# Altium project PCB_Project.PrjPcb
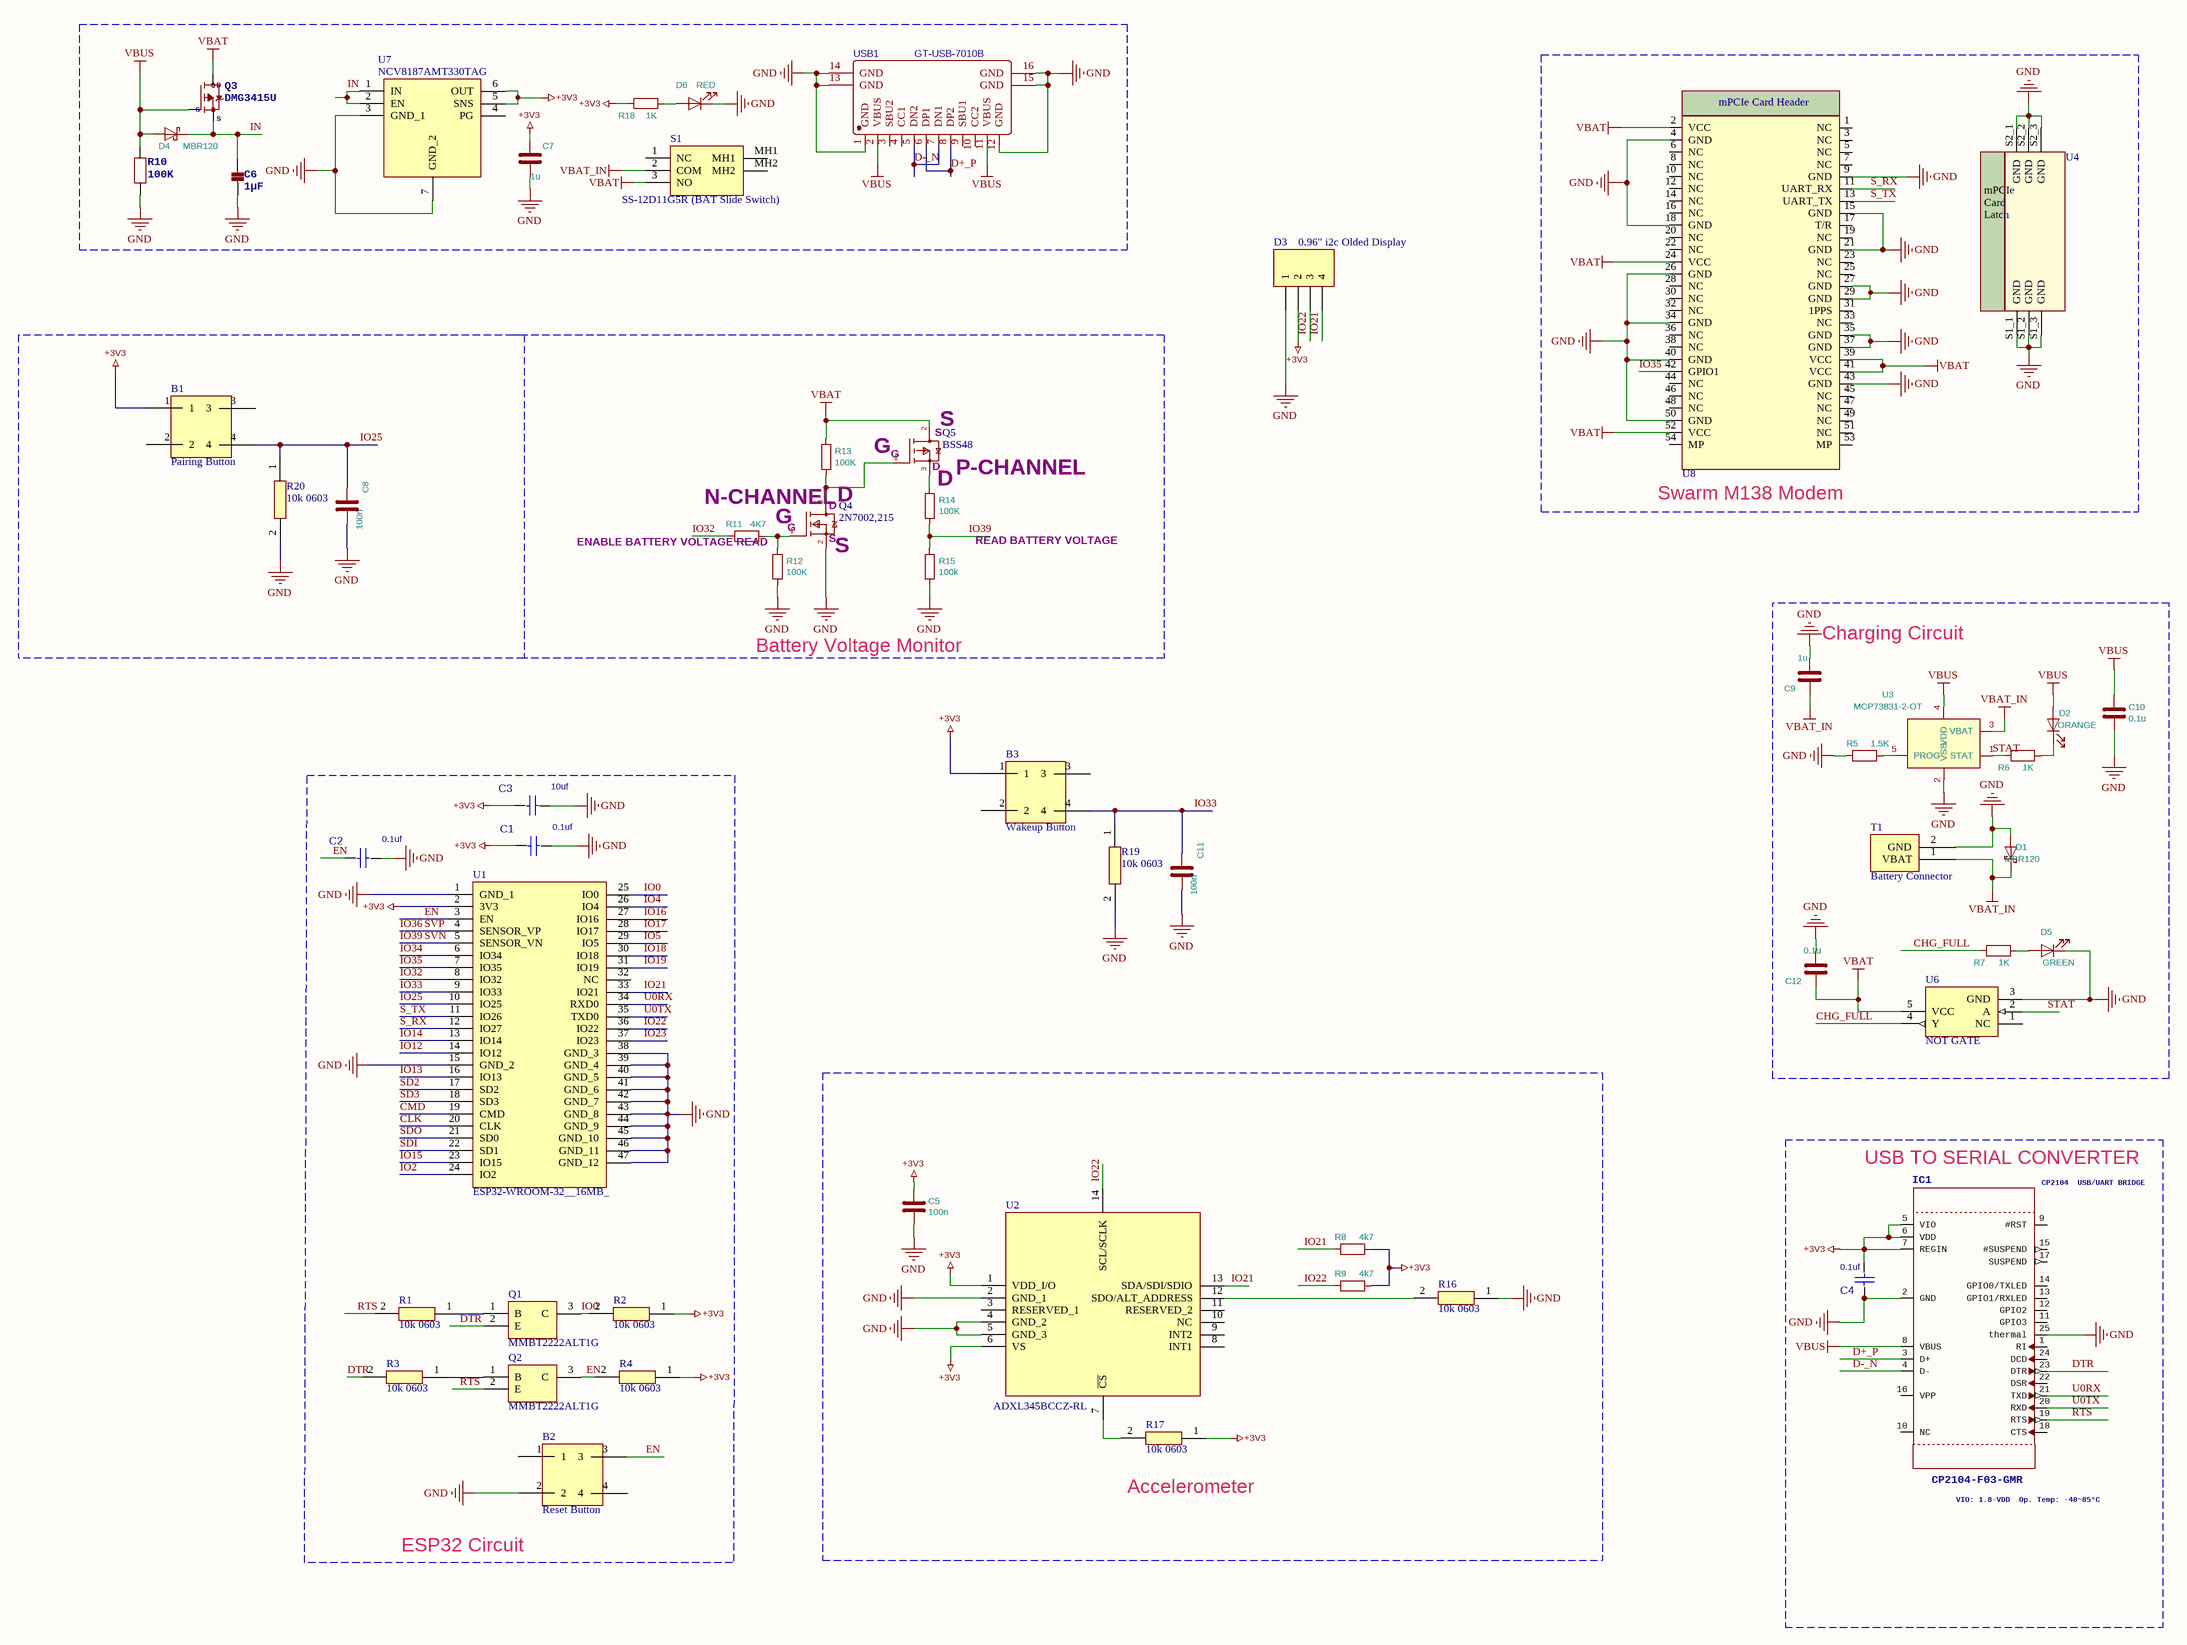
[diagram p0: Sheet1.SchDoc]
1 sheet, 57 parts. Net scope: global (net labels, ports and power ports of the same name join across sheets).
Board file: PCB1.PcbDoc

## Sheet Sheet1.SchDoc
size C

### Parts
B1  Pairing Button  [KMR221NGLFS]
B2  Reset Button  [KMR221NGLFS]
B3  Wakeup Button  [KMR221NGLFS]
C1  value 0.1uf  [0603 Capacitor]  (hidden comment: CAPC1608N-0.1UF)
C2  value 0.1uf  [0603 Capacitor]  (hidden comment: CAPC1608N-0.1UF)
C3  value 10uf  [0603 Capacitor]  (hidden comment: CAPC1608N-0.1UF)
C4  value 0.1uf  [0603 Capacitor]  (hidden comment: CAPC1608N-0.1UF)
C5  100n  [0603 Capacitor]
C6  1µF  [0603 Capacitor]
C7  value 1u  [0603 Capacitor]  (hidden comment: 10u)
C8  100n  [0603 Capacitor]
C9  value 1u  [0603 Capacitor]  (hidden comment: 10u)
C10  value 0.1u  [0603 Capacitor]  (hidden comment: 1u)
C11  100n  [0603 Capacitor]
C12  value 0.1u  [0603 Capacitor]  (hidden comment: 0.1uF)
D1  MBR120  [SODFL3616X98N]
D2  ORANGE  [LED]
D3  0.96" i2c Olded Display  [i2c display]
D4  MBR120  [SODFL3616X98N]
D5  value GREEN  [LED]  (hidden comment: ORANGE)
D6  value RED  [LED]  (hidden comment: ORANGE)
IC1  CP2104-F03-GMR  CP2104
USB/UARTBRIDGE: CP2104 / USB/UART BRIDGE  VIO:1.8-VDD
Op.Temp:-40~85°C: VIO: 1.8-VDD / Op. Temp: -40~85°C  [cp2104]
Q1  MMBT2222ALT1G  [SOT96P237X111-3N]
Q2  MMBT2222ALT1G  [SOT96P237X111-3N]
Q3  DMG3415U  [SOT96P237X111-3N]
Q4  2N7002,215  [SOT96P237X111-3N]
Q5  BSS48  [SOT96P237X111-3N]
R1  10k 0603  [RES0603]
R2  10k 0603  [RES0603]
R3  10k 0603  [RES0603]
R4  10k 0603  [RES0603]
R5  value 1.5K  [RES0603]  (hidden comment: 10K)
R6  1K  [RES0603]
R7  1K  [RES0603]
R8  value 4k7  [RES0603]  (hidden comment: 4k7 0603)
R9  value 4k7  [RES0603]  (hidden comment: 4k7 0603)
R10  100K  [RES0603]
R11  4K7  [RES0603]
R12  100K  [RES0603]
R13  100K  [RES0603]
R14  value 100K  [RES0603]  (hidden comment: 330K)
R15  100K  [RES0603]
R16  10k 0603  [RES0603]
R17  10k 0603  [RES0603]
R18  1K  [RES0603]
R19  10k 0603  [RES0603]
R20  10k 0603  [RES0603]
S1  SS-12D11G5R (BAT Slide Switch)  [SS12D11G5R]
T1  Battery Connector  [Battery Connector]
U1  ESP32-WROOM-32__16MB_  [ESP32]
U2  ADXL345BCCZ-RL  [ADXL345BCCZRL]
U3  MCP73831-2-OT  [SOT95P270X145-5N]
U4  Component_2  [m.2]  (value not drawn)
U6  NOT GATE  [SOT95P270X145-5N]
U7  NCV8187AMT330TAG  [SON65P200X200X80-7N]
U8  SWARM_M138_mPCIe_2.005"_VHF  [RF_VHF_JAE_MM60-52B1-B1-R850_MM60-EZH039-B5-R850_w_2005_mPCIe_card]  (value not drawn)
USB1  GT-USB-7010B  [type c]

### Blocks framed on the sheet
Swarm M138 Modem: U4 U8
Charging Circuit: C9 C10 C12 D1 D2 D5 R5-R7 T1 U3 U6
Accelerometer: C5 R8 R9 R16 R17 U2
USB TO SERIAL CONVERTER: C4 IC1

### Nets
+3V3: B1.1 B3.1 C1.2 C3.2 C4.1 C5.1 C7.1 D3.2 IC1.5(VIO) IC1.6(VDD) IC1.7(REGIN) R2.1 R4.1 R8.1 R9.1 R17.1 R18.2 U1.2(3V3) U2.1(VDD_I/O) U2.6(VS) U7.5(SNS) U7.6(OUT)
GND: B2.2 C1.1 C2.1 C3.1 C4.2 C5.2 C6.2 C7.2 C8.2 C9.2 C10.2 C11.2 C12.2 D1.2(A) D3.1 D5.1(K) D6.1(K) IC1.2(GND) IC1.25(thermal) Q4.2(S) R5.2 R10.1 R12.2 R15.2 R16.1 R19.2 R20.2 T1.2(GND) U1.1(GND_1) U1.15(GND_2) U1.38(GND_3) U1.39(GND_4) U1.40(GND_5) U1.41(GND_6) U1.42(GND_7) U1.43(GND_8) U1.44(GND_9) U1.45(GND_10) U1.46(GND_11) U1.47(GND_12) U2.2(GND_1) U2.4(GND_2) U2.5(GND_3) U3.2(VSS) U4.S1_1(GND) U4.S1_2(GND) U4.S1_3(GND) U4.S2_1(GND) U4.S2_2(GND) U4.S2_3(GND) U6.3(GND) U7.3(GND_1) U7.7(GND_2) U8.4(GND) U8.9(GND) U8.15(GND) U8.18(GND) U8.21(GND) U8.26(GND) U8.27(GND) U8.29(GND) U8.34(GND) U8.35(GND) U8.37(GND) U8.40(GND) U8.43(GND) U8.50(GND) USB1.1(GND) USB1.12(GND) USB1.13(GND) USB1.14(GND) USB1.15(GND) USB1.16(GND)
VBAT: C12.1 Q3.3(D) Q5.2(D1) R13.1 S1.3(NO) U6.5(VCC) U8.2(VCC) U8.24(VCC) U8.39(VCC) U8.41(VCC) U8.52(VCC)
VBAT_IN: C9.1 D1.1(K) S1.2(COM) T1.1(VBAT) U3.3(VBAT)
VBUS: C10.1 D2.2(A) D4.2(A) IC1.8(VBUS) Q3.1(G) R10.2 U3.4(VDD) USB1.2(VBUS) USB1.11(VBUS)
CHG_FULL: R7.2 U6.4(Y)
CLK: U1.20(CLK)
CMD: U1.19(CMD)
D+_P: IC1.3(D+) USB1.6(DP1) USB1.8(DP2)
D-_N: IC1.4(D-) USB1.5(DN2) USB1.7(DN1)
DTR: IC1.23(DTR) Q1.2(E) R3.2
EN: B2.3 C2.2 Q2.3(C) R4.2 U1.3(EN)
IN: C6.1 D4.1(K) Q3.2(S) U7.1(IN) U7.2(EN)
IO0: Q1.3(C) R2.2 U1.25(IO0)
IO2: U1.24(IO2)
IO4: U1.26(IO4)
IO5: U1.29(IO5)
IO12: U1.14(IO12)
IO13: U1.16(IO13)
IO14: U1.13(IO14)
IO15: U1.23(IO15)
IO16: U1.27(IO16)
IO17: U1.28(IO17)
IO18: U1.30(IO18)
IO19: U1.31(IO19)
IO21: D3.4 R8.2 U1.33(IO21) U2.13(SDA/SDI/SDIO)
IO22: D3.3 R9.2 U1.36(IO22) U2.14(SCL/SCLK)
IO23: U1.37(IO23)
IO25: B1.4 C8.1 R20.1 U1.10(IO25)
IO32: R11.2 U1.8(IO32)
IO33: B3.4 C11.1 R19.1 U1.9(IO33)
IO34: U1.6(IO34)
IO35: U1.7(IO35) U8.42(GPIO1)
IO36: U1.4(SENSOR_VP)  [also labelled SVP]
IO39: R14.2 R15.1 U1.5(SENSOR_VN)  [also labelled SVN]
RTS: IC1.19(RTS) Q2.2(E) R1.2
S_RX: U1.12(IO27) U8.11(UART_RX)
S_TX: U1.11(IO26) U8.13(UART_TX)
SD2: U1.17(SD2)
SD3: U1.18(SD3)
SDI: U1.22(SD1)
SDO: U1.21(SD0)
STAT: R6.2 U3.1(STAT) U6.2(A)
U0RX: IC1.21(TXD) U1.34(RXD0)
U0TX: IC1.20(RXD) U1.35(TXD0)
NetD2_1: D2.1(K) R6.1
NetD5_2: D5.2(A) R7.1
NetD6_2: D6.2(A) R18.1
NetQ1_1: Q1.1(B) R1.1
NetQ2_1: Q2.1(B) R3.1
NetQ4_1: Q4.1(G) R11.1 R12.1
NetQ4_3: Q4.3(D1) Q5.1(G) R13.2
NetQ5_3: Q5.3(S) R14.1
NetR5_1: R5.1 U3.5(PROG)
NetR16_2: R16.2 U2.12(SDO/ALT_ADDRESS)
NetR17_2: R17.2 U2.7(~{CS})

Not connected (* = marked no-connect by the designer): B1 2 3; B2 1 4; B3 2 3; IC1 1(RI) 9(#RST) 10(NC) 11(GPIO3) 12(GPIO2) 13(GPIO1/RXLED) 14(GPIO0/TXLED) 15(#SUSPEND) 16(VPP) 17(SUSPEND) 18(CTS) 22(DSR) 24(DCD); S1 1(NC) MH1 MH2; U1 32(NC); U2 3(RESERVED_1) 8(INT1) 9(INT2) 10(NC) 11(RESERVED_2); U6 1(NC); U7 4(PG); U8 1(NC) 3(NC) 5(NC) 6(NC) 7(NC) 8(NC) 10(NC) 12(NC) 14(NC) 16(NC) 17(T/R) 19(NC) 20(NC) 22(NC) 23(NC) 25(NC) 28(NC) 30(NC) 31(1PPS) 32(NC) 33(NC) 36(NC) 38(NC) 44(NC) 45(NC) 46(NC) 47(NC) 48(NC) 49(NC) 51(NC) 53(MP) 54(MP); USB1 3(SBU2) 4(CC1) 9(SBU1) 10(CC2)

### Notes on the sheet
- (near Q5) S
- (near Q4) N-CHANNEL
- D
- (near Q5) G
- P-CHANNEL
- (near R11) ENABLE BATTERY VOLTAGE READ
- G
- (near Q4) S
- READ BATTERY VOLTAGE
- Battery Voltage Monitor
- ESP32 Circuit
- (in symbol 2N7002) D
- (in symbol BSS84) D
- (in symbol Component_2) mPCIe Card Latch
- (in symbol SWARM_M138_mPCIe_2.005"_VHF) mPCIe Card Header

### Library data of the parts
B1-B3 = Button: Manufacturer_Part_Number: KMR221NGLFS; LCSC Part Number: C269272
C1-C4 = CAPC1608N-0.1UF: CAP CER 0.1UF 25V X7R 0603; Manufacturer_Name: TDK Corporation; Manufacturer_Part_Number: CGA3E2X7R1E104K080AA; PCB DECAL: CAPC1608X55N; Mouser Part Number: 963-TMF212B7104KGHT; Mouser Price/Stock: https://www2.mouser.com/ProductDetail/Taiyo-Yuden/TMF212B7104KGHT?qs=%252B6g0mu59x7Jv7XISa3hIWA%3D%3D; LCSC Part Number: *
C5 C8 C11 = 100n_0603: Part Number: C0603C104J5RACTU; Generic Part: no; Manufacturer: KEMET; Value: 100n; Footprint: Capacitor_SMD:C_0603_1608Metric
  C5: LCSC Part Number: *
C6 = CAP_CERAMIC0805-NOOUTLINE: Ceramic Capacitors   For new designs, use the packages preceded by an '_' character since they are more reliable:   The following footprints should be used on most boards: _0402 - Standard footprint for regular board layouts  _0603 - Standard footprint for regular board layouts  _0805 - Standard footprint for regular board layouts  _1206 - Standard footprint for regular board layouts       For extremely tight-pitch boards where space is at a premium, the following 'micro-pitch' footprints can be used (smaller pads, no silkscreen outline, etc.): _0402MP - Micro-pitch footprint for very dense/compact boards  _0603MP - Micro-pitch footprint for very dense/compact boards  _0805MP - Micro-pitch footprint for very dense/compact boards  _1206MP - Micro-pitch footprint for very dense/compact boards; COMPANY: ADAFRUIT INDUSTRIES; DRAWN: KTOWN; REV: B; LCSC Part Number: *; Manufacturer_Part_Number: *
C7 C9 C10 C12 = 10u_0603: Part Number: C0603C106M9PACTU; Generic Part: no; Manufacturer: KEMET; Footprint: Capacitor_SMD:C_0603_1608Metric; LCSC Part Number: *
D1 D4 = MBR0520: Manufacturer_Part_Number: LMBR120FT1G; Generic Part: no; Manufacturer: ON; Value: MBR120; Footprint: Diode_SMD:D_SOD-123; LCSC Part Number: C81143
D2 D6 = LED: Generic Part: yes; Manufacturer: Kingbright; Manufacturer_Part_Number: APT1608SECK; Footprint: LED_SMD:LED_0603_1608Metric; LCSC Part Number: *
  D2: Value: ORANGE
D3 = Header 4: Header, 4-Pin; LatestRevisionDate: 17-Jul-2002; LatestRevisionNote: Re-released for DXP Platform.; Publisher: Altium Limited
D5 = LED: Generic Part: yes; Manufacturer: Kingbright; Part Number: APT1608SECK; Footprint: LED_SMD:LED_0603_1608Metric
IC1 = CP2104: CP2104 - USB to UART Bridge    VDD Output: 3.45V; COMPANY: ADAFRUIT INDUSTRIES; DRAWN: KTOWN; REV: B; LCSC Part Number: C47742; Manufacturer_Part_Number: CP2104-F03-GMR
Q1 Q2 = MMBT2222ALT1G: Integrated Circuit; Manufacturer_Name: ON Semiconductor; Datasheet Link: http://www.onsemi.com/pub/Collateral/MMBT2222LT1-D.PDF; Height: 1.11mm; Manufacturer_Part_Number: MMBT2222ALT1G; Arrow Part Number: MMBT2222ALT1G; Arrow Price/Stock: https://www.arrow.com/en/products/mmbt2222alt1g/on-semiconductor; Mouser Part Number: 863-MMBT2222ALT1G; Mouser Price/Stock: https://www.mouser.co.uk/ProductDetail/ON-Semiconductor/MMBT2222ALT1G?qs=HVbQlW5zcXWwnD7Jokybqg%3D%3D; LCSC Part Number: C82460
Q3 = MOSFET-P: P-Channel Mosfet   LEGEND   VDS: Voltage Drain-Source ID: Drain Current RDS(ON): Drain-Source On-State Resistance VGS(TH): Gate-Source Threshold Voltage CISS: Drain-Source Input Capacitance    SOT-23   Name	VDS	ID	RDS(ON)	VGS(TH)	CISS	Order Number	   IRLML5103	30V	760mA	600 mOhm	--	75pF @ 25V	Digikey: IRLML5103PBFCT-ND	   IRLML6401	12V	4.3A	50 mOhm	950mV @ 250µA	830pF @ 10V	Digikey: IRLML6401PBFTR-ND	   NTR0202PL	20V	400mA	800 mOhm	2.3V @ 250uA	70pF @ 5V	Digikey: NTR0202PLT1GOSTR-ND	   NTR4101PT1G	20V	1.8A	85 mOhm	1.2V @ 250uA	675pF @ 10V	Digikey: NTR4101PT1GOSCT-ND	   DMP2004K	20V	600mA	900 mOhm	1V @ 250uA	175pF @ 16V	Digikey: DMP2004KDICT-ND	   PMV65XP	20V	3.9A	76 mOhm	950mV @ 1mA	725pF @ 20V	Digikey: 568-2358-2-ND	   							   							TO-252   Name	VDS	ID	RDS(ON)	VGS(TH)	CISS	Order Number	   AOD417	30V	25A	34 mOhm	3V @ 250µA	920pF @ 15V	Digikey: 785-1106-2-ND	PowerPak   Name	VDS	ID	RDS(ON)	VGS(TH)	CISS	Order Number	   AON7401	30V	12A	14 mOhm	3V @ 250µA	2600pF @ 15V	Digikey: 785-1302-1-ND; Manufacturer_Part_Number: DMG3415U-7; COMPANY: ADAFRUIT INDUSTRIES; DRAWN: KTOWN; REV: B; D: D; S: S; G: G; LCSC Part Number: C709946
Q4 = 2N7002
Q5 = BSS84
R1-R4 R16 R17 R19 R20 = RGA1608P-103-B-T1: Resistor; Manufacturer_Name: Susumu; Datasheet Link: https://componentsearchengine.com/Datasheets/1/RGA1608P-103-B-T1.pdf; Height: 0.55mm; Manufacturer_Part_Number: RGA1608P-103-B-T1; Arrow Part Number: RGA1608P-103-B-T1; Mouser Part Number: 754-RGA1608P-103BT1; Mouser Price/Stock: https://www.mouser.co.uk/ProductDetail/Susumu/RGA1608P-103-B-T1?qs=bZr6mbWTK5mMUuFD5Afdcw%3D%3D; LCSC Part Number: *
R5 = 10K_0603: Manufacturer_Part_Number: CRCW060310K0FKEAHP; Generic Part: no; Manufacturer: Vishay; Footprint: Resistor_SMD:R_0603_1608Metric; LCSC Part Number: *
R6 R18 = 1K_0603: Manufacturer_Part_Number: CRCW06031K00FKEAHP; Generic Part: no; Manufacturer: Vishay; Value: 1K; Footprint: Resistor_SMD:R_0603_1608Metric; LCSC Part Number: *
R7 = 1K_0603: Part Number: CRCW06031K00FKEAHP; Generic Part: no; Manufacturer: Vishay; Value: 1K; Footprint: Resistor_SMD:R_0603_1608Metric; LCSC Part Number: *
R8 R9 = 10K_0603: Part Number: CRCW060310K0FKEAHP; Generic Part: no; Manufacturer: Vishay; Footprint: Resistor_SMD:R_0603_1608Metric; LCSC Part Number: *
R10 = RESISTOR_0603_NOOUT: Resistors   For new designs, use the packages preceded by an '_' character since they are more reliable:   The following footprints should be used on most boards: _0402 - Standard footprint for regular board layouts  _0603 - Standard footprint for regular board layouts  _0805 - Standard footprint for regular board layouts  _1206 - Standard footprint for regular board layouts       For extremely tight-pitch boards where space is at a premium, the following 'micro-pitch' footprints can be used (smaller pads, no silkscreen outline, etc.): _0402MP - Micro-pitch footprint for very dense/compact boards  _0603MP - Micro-pitch footprint for very dense/compact boards  _0805MP - Micro-pitch footprint for very dense/compact boards  _1206MP - Micro-pitch footprint for very dense/compact boards; COMPANY: ADAFRUIT INDUSTRIES; DRAWN: KTOWN; REV: B; LCSC Part Number: *; Manufacturer_Part_Number: *
R11 = 4K7_0603: Part Number: CRCW06034K70FKEAHP; Generic Part: no; Manufacturer: Vishay; Value: 4K7; Footprint: Resistor_SMD:R_0603_1608Metric
R12 R13 R15 = 100K_0603: Part Number: CRCW0603100KFKEAHP; Generic Part: no; Manufacturer: Vishay; Footprint: Resistor_SMD:R_0603_1608Metric
  R12 R13: Value: 100K
  R15: Value: 100k
R14 = 330K_0603: Part Number: CRCW0603330KFKEAHP; Generic Part: no; Manufacturer: Vishay; Footprint: Resistor_SMD:R_0603_1608Metric
S1 = SS-12D11G5R: Switch; Manufacturer_Name: XKB Connectivity; Datasheet Link: http://www.helloxkb.com/public/images/pdf/SS-12D11G5R-.pdf; Height: 6.8mm; Manufacturer_Part_Number: SS-12D11G5R; LCSC Part Number: *
U1 = ESP32-WROOM-32__16MB_: Integrated Circuit; Manufacturer_Name: Espressif Systems; Manufacturer_Part_Number: ESP32-WROOM-32 (16MB); Datasheet Link: https://www.espressif.com/sites/default/files/documentation/esp32_datasheet_en.pdf; Height: 3.2mm; Arrow Part Number: ESP32-WROOM-32 (16MB); Mouser Part Number: 356-ESPWROOM3216MB; Mouser Price/Stock: https://www.mouser.co.uk/ProductDetail/Espressif-Systems/ESP32-WROOM-32-16MB?qs=w%2Fv1CP2dgqrcPyEPuQvO1A%3D%3D; LCSC Part Number: C529578
U2 = ADXL345BCCZ-RL: Integrated Circuit; Manufacturer_Name: Analog Devices; Datasheet Link: https://www.analog.com/media/en/technical-documentation/data-sheets/ADXL345.pdf; Height: 1mm; Manufacturer_Part_Number: ADXL345BCCZ-RL; Mouser Part Number: 584-ADXL345BCCZ-R; Mouser Price/Stock: https://www.mouser.co.uk/ProductDetail/Analog-Devices/ADXL345BCCZ-RL?qs=WIvQP4zGangSXrz9XHbgiA%3D%3D; Arrow Part Number: ADXL345BCCZ-RL; Arrow Price/Stock: https://www.arrow.com/en/products/adxl345bccz-rl/analog-devices?region=nac
U3 = MCP73831-2-OT: Manufacturer_Part_Number: MCP73831T-2ACI/OT; Generic Part: no; Manufacturer: Microchip Technology; Value: MCP73831-2-OT; Footprint: Package_TO_SOT_SMD:SOT-23-5; LCSC Part Number: *
U6 = SN74LVC1G04DBVR: Integrated Circuit; Manufacturer_Name: Texas Instruments; Datasheet Link: http://www.ti.com/lit/gpn/sn74lvc1g04; Height: 1.45mm; Manufacturer_Part_Number: SN74LVC1G04DBVR; Arrow Part Number: SN74LVC1G04DBVR; Arrow Price/Stock: https://www.arrow.com/en/products/sn74lvc1g04dbvr/texas-instruments; Mouser Part Number: 595-SN74LVC1G04DBVR; Mouser Price/Stock: https://www.mouser.co.uk/ProductDetail/Texas-Instruments/SN74LVC1G04DBVR?qs=AMJt07B76utiScZvQx5a7w%3D%3D; LCSC Part Number: C7827
U7 = NCV8187AMT330TAG: Integrated Circuit; Manufacturer_Name: ON Semiconductor; Datasheet Link: https://www.onsemi.com/pdf/datasheet/ncv8187-d.pdf; Height: 0.8mm; Manufacturer_Part_Number: NCV8187AMT330TAG; Mouser Part Number: 863-NCV8187AMT330TAG; Mouser Price/Stock: https://www.mouser.co.uk/ProductDetail/onsemi/NCV8187AMT330TAG?qs=%252B6g0mu59x7JkSKBMOiGIwA%3D%3D; Arrow Part Number: NCV8187AMT330TAG; Arrow Price/Stock: https://www.arrow.com/en/products/ncv8187amt330tag/on-semiconductor?region=nac
U8 = SWARM_M138_mPCIe_2.005"_VHF: SWARM M138 MODEM mPCIe 2.005" (50.925mm) x 1.18" (30mm)  Two part connector; MANUF1: JAE; SPECIAL_INSTRUCTIONS: A: MM60-52B1-B1-R850 B: MM60-EZH039-B5-R850; TEMP: -40°C ~ 85°C; Size: mPCIe; Supplier: Digikey; Supplier P/N: A: 670-2274-2-ND B: 670-2276-2-ND; Type: CONN; MANUF1 P/N: A: MM60-52B1-B1-R850 B: MM60-EZH039-B5-R850
USB1 = GT-USB-7010B: BOM_Manufacturer: G-Switch(品赞); Contributor: LCSC; BOM_Supplier: LCSC; BOM_Supplier Part: C2837092; BOM_Manufacturer Part: GT-USB-7010B; BOM_JLCPCB Part Class: Extended Part; spicePre: U; spiceSymbolName: GT-USB-7010B